# Altium project MCORD_Hub_v1.1.PrjPcb (part 4 of 4)
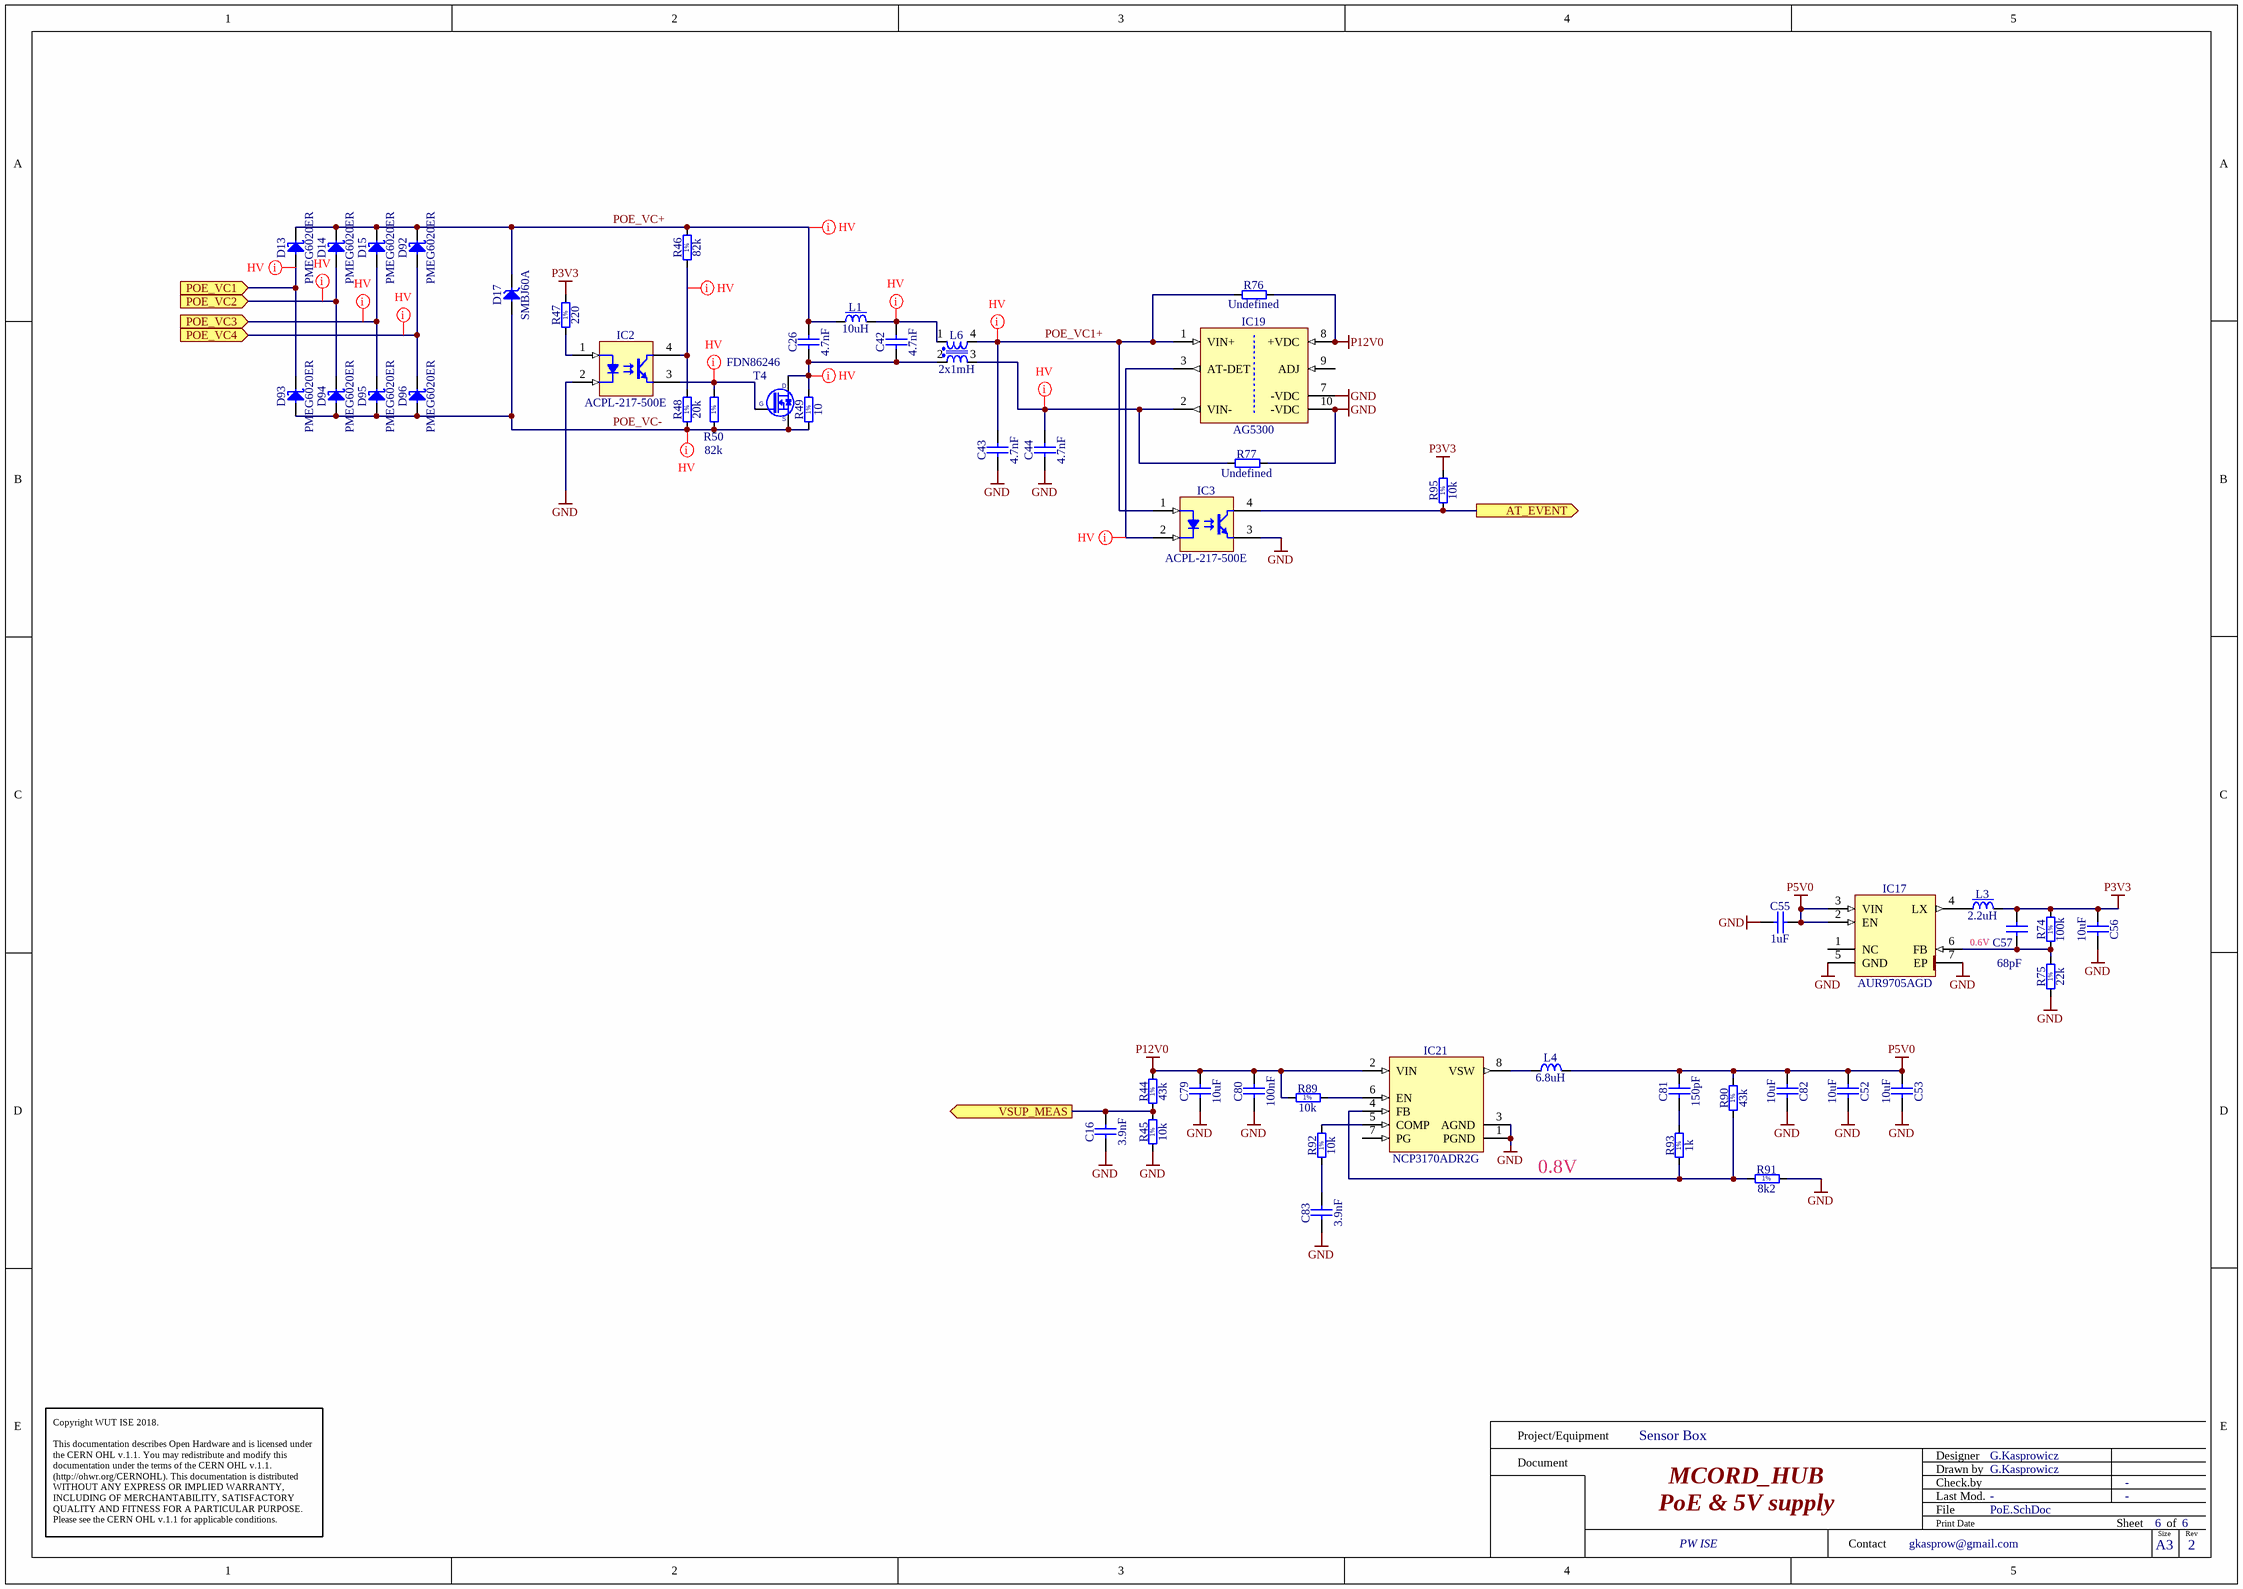
[diagram p7: PoE.SchDoc]

## Nets that join several sheets
GND: MCORD_Hub (53 pins), U_SIPM_ASSY_CON1 (13 pins), U_SIPM_ASSY_CON2 (13 pins), U_SIPM_ASSY_CON3 (13 pins), U_SIPM_ASSY_CON4 (13 pins), U_SIPM_ASSY_CON5 (13 pins), U_SIPM_ASSY_CON6 (13 pins), U_SIPM_ASSY_CON7 (13 pins), U_SIPM_ASSY_CON8 (13 pins), Boost_CNV (28 pins), RMII_Ethernet (21 pins), USB (6 pins), CPU_STM32F7 (78 pins), PoE (23 pins)
P3V3: MCORD_Hub (11 pins), U_SIPM_ASSY_CON1 (R78A.1), U_SIPM_ASSY_CON2 (R78B.1), U_SIPM_ASSY_CON3 (R78C.1), U_SIPM_ASSY_CON4 (R78D.1), U_SIPM_ASSY_CON5 (R78E.1), U_SIPM_ASSY_CON6 (R78F.1), U_SIPM_ASSY_CON7 (R78G.1), U_SIPM_ASSY_CON8 (R78H.1), RMII_Ethernet (8 pins), CPU_STM32F7 (48 pins), PoE (6 pins)
P5V0: U_SIPM_ASSY_CON1 (F2A.1 T1A.2), U_SIPM_ASSY_CON2 (F2B.1 T1B.2), U_SIPM_ASSY_CON3 (F2C.1 T1C.2), U_SIPM_ASSY_CON4 (F2D.1 T1D.2), U_SIPM_ASSY_CON5 (F2E.1 T1E.2), U_SIPM_ASSY_CON6 (F2F.1 T1F.2), U_SIPM_ASSY_CON7 (F2G.1 T1G.2), U_SIPM_ASSY_CON8 (F2H.1 T1H.2), CPU_STM32F7 (6 pins), PoE (9 pins)
P12V0: Boost_CNV (C117.2 IC18.10 L2.1 R6.2), CPU_STM32F7 (J1.1 J4.1), PoE (7 pins)
P70V0: U_SIPM_ASSY_CON1 (R80A.1 T2A.2), U_SIPM_ASSY_CON2 (R80B.1 T2B.2), U_SIPM_ASSY_CON3 (R80C.1 T2C.2), U_SIPM_ASSY_CON4 (R80D.1 T2D.2), U_SIPM_ASSY_CON5 (R80E.1 T2E.2), U_SIPM_ASSY_CON6 (R80F.1 T2F.2), U_SIPM_ASSY_CON7 (R80G.1 T2G.2), U_SIPM_ASSY_CON8 (R80H.1 T2H.2), Boost_CNV (R5.1 U2.4)
AT_EVENT: CPU_STM32F7 (IC9.68), PoE (IC3.4 R95.1)
CAL0_N: MCORD_Hub (IC16.21 R35.1), U_SIPM_ASSY_CON4 (J12D.A10)
CAL0_N: MCORD_Hub (IC16.23 R32.1), U_SIPM_ASSY_CON3 (J12C.A10)
CAL0_N: MCORD_Hub (IC16.27 R61.1), U_SIPM_ASSY_CON2 (J12B.A10)
CAL0_N: MCORD_Hub (IC16.29 R60.1), U_SIPM_ASSY_CON1 (J12A.A10)
CAL0_N: MCORD_Hub (IC16.19 R37.1), U_SIPM_ASSY_CON5 (J12E.A10)
CAL0_N: MCORD_Hub (IC16.17 R39.1), U_SIPM_ASSY_CON6 (J12F.A10)
CAL0_N: MCORD_Hub (IC16.13 R41.1), U_SIPM_ASSY_CON7 (J12G.A10)
CAL0_N: MCORD_Hub (IC16.11 R43.1), U_SIPM_ASSY_CON8 (J12H.A10)
CAL0_P: MCORD_Hub (IC16.22 R33.1), U_SIPM_ASSY_CON4 (J12D.A11)
CAL0_P: MCORD_Hub (IC16.24 R65.1), U_SIPM_ASSY_CON3 (J12C.A11)
CAL0_P: MCORD_Hub (IC16.28 R25.1), U_SIPM_ASSY_CON2 (J12B.A11)
CAL0_P: MCORD_Hub (IC16.30 R55.1), U_SIPM_ASSY_CON1 (J12A.A11)
CAL0_P: MCORD_Hub (IC16.20 R36.1), U_SIPM_ASSY_CON5 (J12E.A11)
CAL0_P: MCORD_Hub (IC16.18 R38.1), U_SIPM_ASSY_CON6 (J12F.A11)
CAL0_P: MCORD_Hub (IC16.14 R40.1), U_SIPM_ASSY_CON7 (J12G.A11)
CAL0_P: MCORD_Hub (IC16.12 R42.1), U_SIPM_ASSY_CON8 (J12H.A11)
CAL_SRC_SEL: MCORD_Hub (IC16.32), CPU_STM32F7 (IC9.59)
CAN_H: U_SIPM_ASSY_CON1 (J12A.B11), U_SIPM_ASSY_CON2 (J12B.B11), U_SIPM_ASSY_CON3 (J12C.B11), U_SIPM_ASSY_CON4 (J12D.B11), U_SIPM_ASSY_CON5 (J12E.B11), U_SIPM_ASSY_CON6 (J12F.B11), U_SIPM_ASSY_CON7 (J12G.B11), U_SIPM_ASSY_CON8 (J12H.B11), CPU_STM32F7 (D8.1 IC1.7 R19.2)
CAN_L: U_SIPM_ASSY_CON1 (J12A.B10), U_SIPM_ASSY_CON2 (J12B.B10), U_SIPM_ASSY_CON3 (J12C.B10), U_SIPM_ASSY_CON4 (J12D.B10), U_SIPM_ASSY_CON5 (J12E.B10), U_SIPM_ASSY_CON6 (J12F.B10), U_SIPM_ASSY_CON7 (J12G.B10), U_SIPM_ASSY_CON8 (J12H.B10), CPU_STM32F7 (D8.2 IC1.6 R19.1)
CC1: U_SIPM_ASSY_CON1 (D5A.1 J12A.A5 J12A.B5 R78A.2), CPU_STM32F7 (IC9.141)
CC2: U_SIPM_ASSY_CON2 (D5B.1 J12B.A5 J12B.B5 R78B.2), CPU_STM32F7 (IC9.142)
CC3: U_SIPM_ASSY_CON3 (D5C.1 J12C.A5 J12C.B5 R78C.2), CPU_STM32F7 (IC9.1)
CC4: U_SIPM_ASSY_CON4 (D5D.1 J12D.A5 J12D.B5 R78D.2), CPU_STM32F7 (IC9.2)
CC5: U_SIPM_ASSY_CON5 (D5E.1 J12E.A5 J12E.B5 R78E.2), CPU_STM32F7 (IC9.3)
CC6: U_SIPM_ASSY_CON6 (D5F.1 J12F.A5 J12F.B5 R78F.2), CPU_STM32F7 (IC9.4)
CC7: U_SIPM_ASSY_CON7 (D5G.1 J12G.A5 J12G.B5 R78G.2), CPU_STM32F7 (IC9.5)
CC8: U_SIPM_ASSY_CON8 (D5H.1 J12H.A5 J12H.B5 R78H.2), CPU_STM32F7 (IC9.58)
DET_OUT0_N: MCORD_Hub (J6.B3), U_SIPM_ASSY_CON1 (J12A.A3)
DET_OUT0_N: MCORD_Hub (J6.B6), U_SIPM_ASSY_CON2 (J12B.A3)
DET_OUT0_N: MCORD_Hub (J6.B9), U_SIPM_ASSY_CON3 (J12C.A3)
DET_OUT0_N: MCORD_Hub (J6.B12), U_SIPM_ASSY_CON4 (J12D.A3)
DET_OUT0_N: MCORD_Hub (J7.B3), U_SIPM_ASSY_CON5 (J12E.A3)
DET_OUT0_N: MCORD_Hub (J7.B6), U_SIPM_ASSY_CON6 (J12F.A3)
DET_OUT0_N: MCORD_Hub (J7.B9), U_SIPM_ASSY_CON7 (J12G.A3)
DET_OUT0_N: MCORD_Hub (J7.B12), U_SIPM_ASSY_CON8 (J12H.A3)
DET_OUT0_P: MCORD_Hub (J6.B2), U_SIPM_ASSY_CON1 (J12A.A2)
DET_OUT0_P: MCORD_Hub (J6.B5), U_SIPM_ASSY_CON2 (J12B.A2)
DET_OUT0_P: MCORD_Hub (J6.B8), U_SIPM_ASSY_CON3 (J12C.A2)
DET_OUT0_P: MCORD_Hub (J6.B11), U_SIPM_ASSY_CON4 (J12D.A2)
DET_OUT0_P: MCORD_Hub (J7.B2), U_SIPM_ASSY_CON5 (J12E.A2)
DET_OUT0_P: MCORD_Hub (J7.B5), U_SIPM_ASSY_CON6 (J12F.A2)
DET_OUT0_P: MCORD_Hub (J7.B8), U_SIPM_ASSY_CON7 (J12G.A2)
DET_OUT0_P: MCORD_Hub (J7.B11), U_SIPM_ASSY_CON8 (J12H.A2)
DET_OUT1_N: MCORD_Hub (J6.A3), U_SIPM_ASSY_CON1 (J12A.B3)
DET_OUT1_N: MCORD_Hub (J6.A6), U_SIPM_ASSY_CON2 (J12B.B3)
DET_OUT1_N: MCORD_Hub (J6.A9), U_SIPM_ASSY_CON3 (J12C.B3)
DET_OUT1_N: MCORD_Hub (J6.A12), U_SIPM_ASSY_CON4 (J12D.B3)
DET_OUT1_N: MCORD_Hub (J7.A3), U_SIPM_ASSY_CON5 (J12E.B3)
DET_OUT1_N: MCORD_Hub (J7.A6), U_SIPM_ASSY_CON6 (J12F.B3)
DET_OUT1_N: MCORD_Hub (J7.A9), U_SIPM_ASSY_CON7 (J12G.B3)
DET_OUT1_N: MCORD_Hub (J7.A12), U_SIPM_ASSY_CON8 (J12H.B3)
DET_OUT1_P: MCORD_Hub (J6.A2), U_SIPM_ASSY_CON1 (J12A.B2)
DET_OUT1_P: MCORD_Hub (J6.A5), U_SIPM_ASSY_CON2 (J12B.B2)
DET_OUT1_P: MCORD_Hub (J6.A8), U_SIPM_ASSY_CON3 (J12C.B2)
DET_OUT1_P: MCORD_Hub (J6.A11), U_SIPM_ASSY_CON4 (J12D.B2)
DET_OUT1_P: MCORD_Hub (J7.A2), U_SIPM_ASSY_CON5 (J12E.B2)
DET_OUT1_P: MCORD_Hub (J7.A5), U_SIPM_ASSY_CON6 (J12F.B2)
DET_OUT1_P: MCORD_Hub (J7.A8), U_SIPM_ASSY_CON7 (J12G.B2)
DET_OUT1_P: MCORD_Hub (J7.A11), U_SIPM_ASSY_CON8 (J12H.B2)
DIS_HV_BUCK: Boost_CNV (IC18.3), CPU_STM32F7 (IC9.63)
EN_HV_LDO: Boost_CNV (IC6.5 R31.1), CPU_STM32F7 (IC9.65)
I_SIPM_MEAS: Boost_CNV (C14.2 R73.2), CPU_STM32F7 (IC9.28)
INT_CAL_PULSE: MCORD_Hub (C19.2), CPU_STM32F7 (IC9.60)
OK_LED1: U_SIPM_ASSY_CON1 (R56A.2), CPU_STM32F7 (IC9.77)
OK_LED2: U_SIPM_ASSY_CON2 (R56B.2), CPU_STM32F7 (IC9.78)
OK_LED3: U_SIPM_ASSY_CON3 (R56C.2), CPU_STM32F7 (IC9.79)
OK_LED4: U_SIPM_ASSY_CON4 (R56D.2), CPU_STM32F7 (IC9.80)
OK_LED5: U_SIPM_ASSY_CON5 (R56E.2), CPU_STM32F7 (IC9.81)
OK_LED6: U_SIPM_ASSY_CON6 (R56F.2), CPU_STM32F7 (IC9.82)
OK_LED7: U_SIPM_ASSY_CON7 (R56G.2), CPU_STM32F7 (IC9.85)
OK_LED8: U_SIPM_ASSY_CON8 (R56H.2), CPU_STM32F7 (IC9.86)
OL_AFE_5V_1: U_SIPM_ASSY_CON1 (R58A.1 R82A.2), CPU_STM32F7 (IC9.10)
OL_AFE_5V_2: U_SIPM_ASSY_CON2 (R58B.1 R82B.2), CPU_STM32F7 (IC9.11)
OL_AFE_5V_3: U_SIPM_ASSY_CON3 (R58C.1 R82C.2), CPU_STM32F7 (IC9.12)
OL_AFE_5V_4: U_SIPM_ASSY_CON4 (R58D.1 R82D.2), CPU_STM32F7 (IC9.13)
OL_AFE_5V_5: U_SIPM_ASSY_CON5 (R58E.1 R82E.2), CPU_STM32F7 (IC9.14)
OL_AFE_5V_6: U_SIPM_ASSY_CON6 (R58F.1 R82F.2), CPU_STM32F7 (IC9.15)
OL_AFE_5V_7: U_SIPM_ASSY_CON7 (R58G.1 R82G.2), CPU_STM32F7 (IC9.18)
OL_AFE_5V_8: U_SIPM_ASSY_CON8 (R58H.1 R82H.2), CPU_STM32F7 (IC9.19)
OL_AFE_HV_1: U_SIPM_ASSY_CON1 (R57A.2 R62A.1 R83A.1), CPU_STM32F7 (IC9.56)
OL_AFE_HV_2: U_SIPM_ASSY_CON2 (R57B.2 R62B.1 R83B.1), CPU_STM32F7 (IC9.57)
OL_AFE_HV_3: U_SIPM_ASSY_CON3 (R57C.2 R62C.1 R83C.1), CPU_STM32F7 (IC9.87)
OL_AFE_HV_4: U_SIPM_ASSY_CON4 (R57D.2 R62D.1 R83D.1), CPU_STM32F7 (IC9.88)
OL_AFE_HV_5: U_SIPM_ASSY_CON5 (R57E.2 R62E.1 R83E.1), CPU_STM32F7 (IC9.89)
OL_AFE_HV_6: U_SIPM_ASSY_CON6 (R57F.2 R62F.1 R83F.1), CPU_STM32F7 (IC9.90)
OL_AFE_HV_7: U_SIPM_ASSY_CON7 (R57G.2 R62G.1 R83G.1), CPU_STM32F7 (IC9.91)
OL_AFE_HV_8: U_SIPM_ASSY_CON8 (R57H.2 R62H.1 R83H.1), CPU_STM32F7 (IC9.92)
POES_IN1: RMII_Ethernet (J24.7), PoE (D13.2 D93.1)
POES_IN2: RMII_Ethernet (J24.2), PoE (D92.2 D96.1)
POES_IN3: RMII_Ethernet (J24.6), PoE (D14.2 D94.1)
POES_IN4: RMII_Ethernet (J24.1), PoE (D15.2 D95.1)
RMII_CRS_DV: RMII_Ethernet (R150.1), CPU_STM32F7 (IC9.43)
RMII_MDC: RMII_Ethernet (IC23.13), CPU_STM32F7 (IC9.27)
RMII_MDIO: RMII_Ethernet (IC23.12 R98.2), CPU_STM32F7 (IC9.36)
RMII_REF_CLK: RMII_Ethernet (R84.1), CPU_STM32F7 (IC9.35)
RMII_RXD0: RMII_Ethernet (R146.1), CPU_STM32F7 (IC9.44)
RMII_RXD1: RMII_Ethernet (R147.1), CPU_STM32F7 (IC9.45)
RMII_TX_EN: RMII_Ethernet (IC23.16), CPU_STM32F7 (IC9.126)
RMII_TXD0: RMII_Ethernet (IC23.17), CPU_STM32F7 (IC9.128)
RMII_TXD1: RMII_Ethernet (IC23.18), CPU_STM32F7 (IC9.74)
U_SIPM_MEAS: Boost_CNV (C15.2 R27.1 R28.2), CPU_STM32F7 (IC9.37)
USB_ID: USB (C75.2 FB8.1), CPU_STM32F7 (IC9.102)
USB_N: USB (D18.3 L9.2), CPU_STM32F7 (IC9.103)
USB_P: USB (D18.2 L9.3), CPU_STM32F7 (IC9.104)
USB_VBUS: USB (R155.1 R156.1), CPU_STM32F7 (IC9.101)
VSUP_MEAS: CPU_STM32F7 (IC9.29), PoE (C16.2 R44.1 R45.2)